# Altium schematic sheet BQ24073_锂电池充电.SchDoc
size A4; DocumentNumber: 16; SheetNumber: 16; SheetTotal: 34
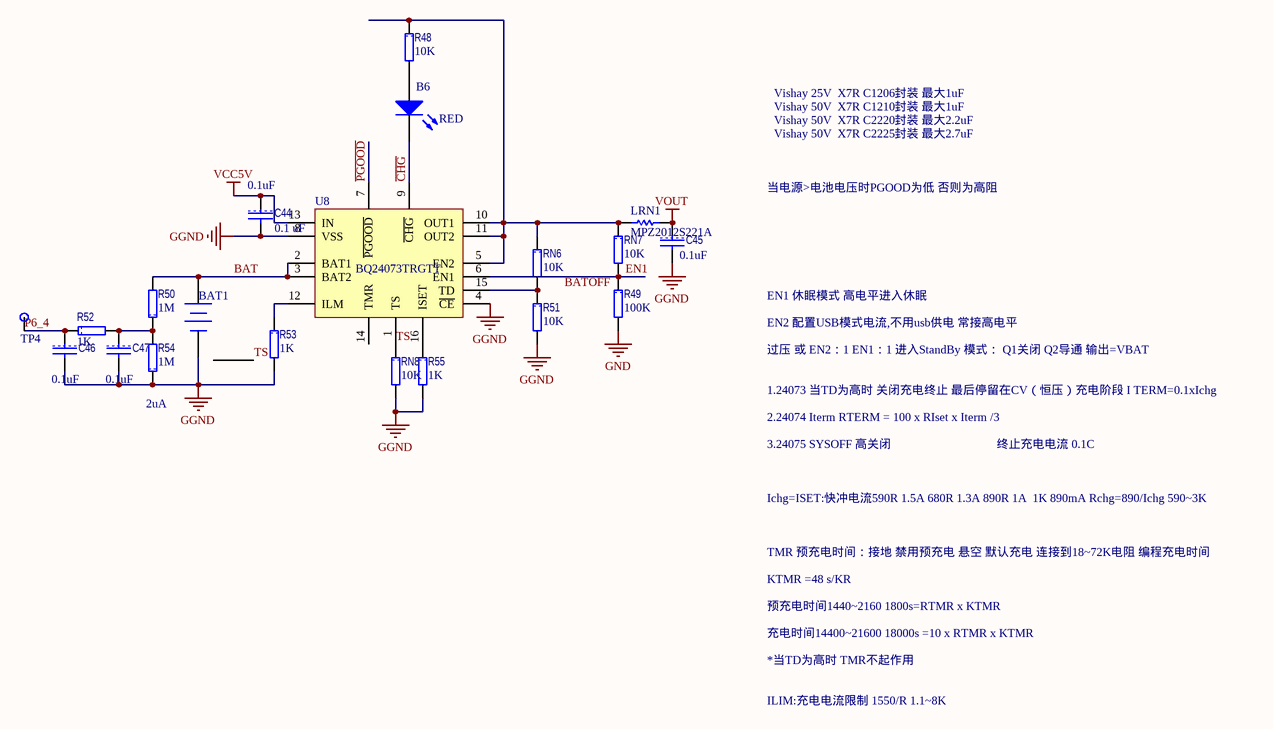
[diagram p0: BQ24073_锂电池充电.SchDoc]

## Parts
B6  RED  [0805LED]
BAT1  18650/5000mAH/3.7V  [BAT_3]  (value not drawn)
C44  value 0.1uF  电容: 0.1 uF  [1608[0603]C]  (hidden comment: C1608X7R1H104K)
C45  value 0.1uF  [1608[0603]C]  (hidden comment: C1608X7R1H104K)
C46  value 0.1uF  [1608[0603]C]  (hidden comment: C1608X7R1H104K)
C47  value 0.1uF  [1608[0603]C]  (hidden comment: C1608X7R1H104K)
LRN1  MPZ2012S221A  [2012[0805]]
R48  value 10K  [1608[0603]R]  (hidden comment: CRCW060310K0FKEA)
R49  value 100K  [1608[0603]R]  (hidden comment: CRCW0603100KFKEA)
R50  value 1M  [1608[0603]R]  (hidden comment: CRCW06031M00FKEA)
R51  value 10K  [1608[0603]R]  (hidden comment: CRCW060310K0FKEA)
R52  value 1K  [1608[0603]R]  (hidden comment: CRCW06031K00FKEA)
R53  value 1K  [1608[0603]R]  (hidden comment: CRCW06031K00FKEA)
R54  value 1M  [1608[0603]R]  (hidden comment: CRCW06031M00FKEA)
R55  value 1K  [1608[0603]R]  (hidden comment: CRCW06031K00FKEA)
RN6  value 10K  [1608[0603]RN]  (hidden comment: CRCW060310K0FKEA)
RN7  value 10K  [1608[0603]RN]  (hidden comment: CRCW060310K0FKEA)
RN8  value 10K  [1608[0603]RN]  (hidden comment: CRCW060310K0FKEA)
TP4  TP  [TP]  (value not drawn)
U8  BQ24073TRGTT  [BQ24073]

## Nets
GGND: BAT1.2(-) C44.2 C45.2 C46.2 C47.2 R51.2 R53.2 R54.1 R55.2 RN8.2 U8.4(~{CE}) U8.8(VSS)
GND: R49.2
VCC5V: C44.1 U8.13(IN)
VOUT: C45.1 LRN1.2
BAT: BAT1.1(+) R50.2 U8.2(BAT1) U8.3(BAT2)
~{CHG}: B6.2(K) U8.9(~{CHG})
EN1: R49.1 RN7.2 U8.6(EN1)
P6_4: C46.1 R52.1 TP4.1(TestPoint)
~{PGOOD}: U8.7(~{PGOOD})
TS: BAT1.3(TS) RN8.1 U8.1(TS)
NetB6_1: B6.1(A) R48.2
NetC47_1: C47.1 R50.1 R52.2 R54.2
NetLRN1_1: LRN1.1 R48.1 RN6.1 RN7.1 U8.5(EN2) U8.10(OUT1) U8.11(OUT2)
NetR51_1: R51.1 RN6.2 U8.15(TD)
NetR53_1: R53.1 U8.12(ILM)
NetR55_1: R55.1 U8.16(ISET)

Not connected (* = marked no-connect by the designer): U8 14(TMR)

## Notes on the sheet
- Vishay 25V  X7R C1206封装 最大1uF
- Vishay 50V  X7R C2225封装 最大2.7uF
- Vishay 50V  X7R C2220封装 最大2.2uF
- Vishay 50V  X7R C1210封装 最大1uF
- 当电源>电池电压时PGOOD为低 否则为高阻
- EN1 休眠模式 高电平进入休眠
- 过压 或 EN2：1 EN1：1 进入StandBy 模式： Q1关闭 Q2导通 输出=VBAT
- EN2 配置USB模式电流,不用usb供电 常接高电平
- (near R54) 2uA
- 1.24073 当TD为高时 关闭充电终止 最后停留在CV（恒压）充电阶段 I TERM=0.1xIchg
- 2.24074 Iterm RTERM = 100 x RIset x Iterm /3
- Ichg=ISET:快冲电流590R 1.5A 680R 1.3A 890R 1A  1K 890mA Rchg=890/Ichg 590~3K
- 3.24075 SYSOFF 高关闭
- 终止充电电流 0.1C
- TMR 预充电时间：接地 禁用预充电 悬空 默认充电 连接到18~72K电阻 编程充电时间
- KTMR =48 s/KR
- 预充电时间1440~2160 1800s=RTMR x KTMR
- 充电时间14400~21600 18000s =10 x RTMR x KTMR
- ILIM:充电电流限制 1550/R 1.1~8K
- *当TD为高时 TMR不起作用
- Labels drawn without touching a wire or pin: BATOFF

## Library data of the parts
B6 = LED2: Typical RED, GREEN, YELLOW, AMBER GaAs LED; Published: 8-Jun-2000; LatestRevisionDate: 17-Jul-2002; LatestRevisionNote: Re-released for DXP Platform.; PackageVersion: Feb-2002; PackageReference: 3.2X1.6X1.1; Publisher: Altium Limited; PackageDescription: SM LED; 2 Flat Leads
BAT1 = Battery: 插针 Multicell Battery
C44 C45 = CAP: 多层陶瓷电容器MLCC - SMD/SMT 0603 0.1uF 50volts X7R 10%; Manufacturer: TDK; 尺寸: 0.8 mm W x 1.6 mm L x 0.8 mm H; 工作温度范围: - 55 C to + 125 C; 封装 / 箱体: 0603 (1608 metric); 封装: Reel; 产品: General Type MLCCs; 系列: C; 电压额定值: 50 V; 电容-nF: 100 nF; 电容-pF: 100000 pF; 外壳代码 - in: 0603; 外壳代码 - mm: 1608; 产品种类: Low & Medium Capacitance SMD Ceramic Chip Capacitors; 标准包装数量: 4000; Supplier 1: Mouser; Supplier Part Number 1: 810-C1608X7R1H104K; Manufacturer Part Number: C1608X7R1H104K; RoHS: RoHS Compliant; Description 1: 多层陶瓷电容器MLCC - SMD/SMT 0603 0.1uF 50volts X7R 10%; Category: 多层陶瓷电容器MLCC - SMD/SMT; Stock 1: 224604; Pricing 1: 1=0.160, 50=0.070, 100=0.036, 500=0.019, 1000=0.013, 4000=0.010, 8000=0.009, 12000=0.008, 20000=0.007 (USD); 端接类型: SMD/SMT; 容差: 10 %; 制造商: TDK; 温度系数/代码: X7R; RoHS - 贸泽: Y; Minimum Order Quantity: 1; Reeling: True; ComponentLink1URL: http://www.tdk.com/pdf/general_B11.pdf; ComponentLink1Description: http://www.tdk.com/pdf/general_B11.pdf
  C45: 电容: 0.1 uF
C46 C47 = CAP: 多层陶瓷电容器MLCC - SMD/SMT 0603 0.1uF 50volts X7R 10%; Manufacturer: TDK; 产品: General Type MLCCs; 产品种类: Low & Medium Capacitance SMD Ceramic Chip Capacitors; 外壳代码 - in: 0603; 外壳代码 - mm: 1608; 封装 / 箱体: 0603 (1608 metric); 封装: Reel; 尺寸: 0.8 mm W x 1.6 mm L x 0.8 mm H; 工作温度范围: - 55 C to + 125 C; 标准包装数量: 4000; 电压额定值: 50 V; 电容-nF: 100 nF; 电容-pF: 100000 pF; 系列: C; Category: 多层陶瓷电容器MLCC - SMD/SMT; ComponentLink1Description: http://www.tdk.com/pdf/general_B11.pdf; ComponentLink1URL: http://www.tdk.com/pdf/general_B11.pdf; Description 1: 多层陶瓷电容器MLCC - SMD/SMT 0603 0.1uF 50volts X7R 10%; Manufacturer Part Number: C1608X7R1H104K; Minimum Order Quantity: 1; Pricing 1: 1=0.160, 50=0.070, 100=0.036, 500=0.019, 1000=0.013, 4000=0.010, 8000=0.009, 12000=0.008, 20000=0.007 (USD); Reeling: True; RoHS - 贸泽: Y; RoHS: RoHS Compliant; Stock 1: 224604; Supplier 1: Mouser; Supplier Part Number 1: 810-C1608X7R1H104K; 制造商: TDK; 容差: 10 %; 温度系数/代码: X7R; 电容: 0.1 uF; 端接类型: SMD/SMT
LRN1 = Res Semi: 电磁干扰滤波珠子、扼流圈和阵列 Ferrite Chip Beads; Manufacturer: TDK; 阻抗: 220 Ohms; 最大直流电流: 3 A; 最大直流电阻: 0.04 Ohms; 工作温度范围: - 55 C to + 125 C; 封装 / 箱体: 2012; 封装: Reel; 端接类型: SMD/SMT; 容差: 25 %; 产品种类: Ferrite Beads; 标准包装数量: 4000; Supplier 1: Mouser; Supplier Part Number 1: 810-MPZ2012S221A; Manufacturer Part Number: MPZ2012S221A; RoHS: RoHS Compliant; Description 1: 电磁干扰滤波珠子、扼流圈和阵列 Ferrite Chip Beads; Category: 电磁干扰滤波珠子、扼流圈和阵列; Stock 1: 26540; Pricing 1: 1=0.070, 50=0.060, 100=0.053, 500=0.040, 1000=0.035, 4000=0.031, 8000=0.029, 12000=0.025 (USD); 制造商: TDK; RoHS - 贸泽: Y; Minimum Order Quantity: 1; Reeling: True; ComponentLink1URL: http://www.mouser.com/ds/2/400/e9413_mpz-24582.pdf; ComponentLink1Description: http://www.mouser.com/ds/2/400/e9413_mpz-24582.pdf
R48 R51 RN6-RN8 = RES: 厚膜电阻器 - SMD 1/10watt 10Kohms 1%; Manufacturer: Vishay / Dale; 尺寸: 0.85 mm W x 1.55 mm L x 0.45 mm H; 工作温度范围: - 55 C to + 155 C; 封装 / 箱体: 0603 (1608 metric); 封装: Reel; 功率额定值: 100 mW; 产品: Thick Film Resistors SMD; 系列: CRCW; 温度系数: 100 PPM / K; 端接类型: SMD/SMT; 电压额定值: 75 V; 制造商: Vishay; 产品种类: 0603 Thick Film Chip Resistors; 标准包装数量: 5000; 外壳代码 - in: 0603; 外壳代码 - mm: 1608; Supplier 1: Mouser; Supplier Part Number 1: 71-CRCW0603-10K-E3; Manufacturer Part Number: CRCW060310K0FKEA; RoHS: RoHS Compliant By Exemption; Category: 厚膜电阻器 - SMD; Stock 1: 0; Pricing 1: 1=0.080, 10=0.013, 100=0.010, 1000=0.008, 5000=0.005, 25000=0.004, 50000=0.003 (USD); 电阻: 10 kOhms; 容差: 1 %; RoHS - 贸泽: E; Minimum Order Quantity: 1; Reeling: True; ComponentLink1URL: http://www.mouser.com/ds/2/427/dcrcwe3-109170.pdf; ComponentLink1Description: http://www.mouser.com/ds/2/427/dcrcwe3-109170.pdf; Description 1: 厚膜电阻器 - SMD 1/10watt 10Kohms 1%
R49 = RES: 厚膜电阻器 - SMD 1/10watt 100Kohms 1%; Manufacturer: Vishay / Dale; 尺寸: 0.85 mm W x 1.55 mm L x 0.45 mm H; 工作温度范围: - 55 C to + 155 C; 封装 / 箱体: 0603 (1608 metric); 封装: Reel; 功率额定值: 100 mW; 产品: Thick Film Resistors SMD; 系列: CRCW; 温度系数: 100 PPM / K; 端接类型: SMD/SMT; 电压额定值: 75 V; 制造商: Vishay; 产品种类: 0603 Thick Film Chip Resistors; 标准包装数量: 5000; 外壳代码 - in: 0603; 外壳代码 - mm: 1608; Supplier 1: Mouser; Supplier Part Number 1: 71-CRCW0603-100K-E3; Manufacturer Part Number: CRCW0603100KFKEA; RoHS: RoHS Compliant By Exemption; Category: 厚膜电阻器 - SMD; Stock 1: 175756; Pricing 1: 1=0.080, 10=0.013, 100=0.010, 1000=0.008, 5000=0.005, 25000=0.004, 50000=0.003 (USD); 电阻: 100 kOhms; 容差: 1 %; RoHS - 贸泽: E; Minimum Order Quantity: 1; Reeling: True; ComponentLink1URL: http://www.mouser.com/ds/2/427/dcrcwe3-109170.pdf; ComponentLink1Description: http://www.mouser.com/ds/2/427/dcrcwe3-109170.pdf; Description 1: 厚膜电阻器 - SMD 1/10watt 100Kohms 1%
R50 R54 = RES: 厚膜电阻器 - SMD 1/10watt 1.0Mohms 1%; Manufacturer: Vishay / Dale; 尺寸: 0.85 mm W x 1.55 mm L x 0.45 mm H; 工作温度范围: - 55 C to + 155 C; 封装 / 箱体: 0603 (1608 metric); 封装: Reel; 功率额定值: 100 mW; 产品: Thick Film Resistors SMD; 电阻: 1 MOhms; 系列: CRCW; 温度系数: 100 PPM / K; 端接类型: SMD/SMT; 电压额定值: 75 V; 外壳代码 - in: 0603; 外壳代码 - mm: 1608; 制造商: Vishay; 产品种类: 0603 Thick Film Chip Resistors; 标准包装数量: 5000; Supplier 1: Mouser; Supplier Part Number 1: 71-CRCW0603-1.0M-E3; Manufacturer Part Number: CRCW06031M00FKEA; RoHS: RoHS Compliant By Exemption; Category: 厚膜电阻器 - SMD; Stock 1: 71394; Pricing 1: 1=0.080, 10=0.013, 100=0.010, 1000=0.008, 5000=0.005, 25000=0.004, 50000=0.003 (USD); 容差: 1 %; RoHS - 贸泽: E; Minimum Order Quantity: 1; Reeling: True; ComponentLink1URL: http://www.mouser.com/ds/2/427/dcrcwe3-109170.pdf; ComponentLink1Description: http://www.mouser.com/ds/2/427/dcrcwe3-109170.pdf; Description 1: 厚膜电阻器 - SMD 1/10watt 1.0Mohms 1%
R52 R53 R55 = RES: 厚膜电阻器 - SMD 1/10watt 1.0Kohms 1%; Manufacturer: Vishay / Dale; 尺寸: 0.85 mm W x 1.55 mm L x 0.45 mm H; 工作温度范围: - 55 C to + 155 C; 封装 / 箱体: 0603 (1608 metric); 封装: Reel; 功率额定值: 100 mW; 产品: Thick Film Resistors SMD; 电阻: 1 kOhms; 系列: CRCW; 温度系数: 100 PPM / K; 端接类型: SMD/SMT; 电压额定值: 75 V; 制造商: Vishay; 产品种类: 0603 Thick Film Chip Resistors; 标准包装数量: 5000; 外壳代码 - in: 0603; 外壳代码 - mm: 1608; Supplier 1: Mouser; Supplier Part Number 1: 71-CRCW0603-1.0K-E3; Manufacturer Part Number: CRCW06031K00FKEA; RoHS: RoHS Compliant By Exemption; Category: 厚膜电阻器 - SMD; Stock 1: 276938; Pricing 1: 1=0.080, 10=0.013, 100=0.010, 1000=0.008, 5000=0.005, 25000=0.004, 50000=0.003 (USD); 容差: 1 %; RoHS - 贸泽: E; Minimum Order Quantity: 1; Reeling: True; ComponentLink1URL: http://www.mouser.com/ds/2/427/dcrcwe3-109170.pdf; ComponentLink1Description: http://www.mouser.com/ds/2/427/dcrcwe3-109170.pdf; Description 1: 厚膜电阻器 - SMD 1/10watt 1.0Kohms 1%
TP4 = Test Point
U8 = BQ24073: 电池管理 1.5A USB-Friendly Li Ion Batt Charger; Manufacturer: Texas Instruments; Manufacturer Part Number: BQ24075TRGTT; 输出电流: 5 A; 输出电压: 5.5 V; 封装 / 箱体: QFN-16; 封装: Reel; 系列: BQ24075T; 电荷安全定时器: Yes; 安装风格: SMD/SMT; 电池类型: Li-Ion; 最大功率耗散: 2.3 W; 工作电源电流: 1.5 mA; 工作电源电压: 4.35 V to 26 V; 产品种类: Battery Management; 产品类型: Charge Management; 标准包装数量: 250; Supplier 1: Mouser; Supplier Part Number 1: 595-BQ24075TRGTT; RoHS: RoHS Compliant; Description 1: 电池管理 1.5A USB-Friendly Li Ion Batt Charger; Category: 电池管理; Stock 1: 641; Pricing 1: 1=2.60, 10=2.33, 25=2.08, 50=1.96, 100=1.40, 250=1.37, 500=1.35, 750=1.32, 1000=1.30 (USD); 温度监测: Yes; 制造商: Texas Instruments; RoHS - 贸泽: Y; Minimum Order Quantity: 1; Reeling: True; ComponentLink1URL: http://www.mouser.com/ds/2/405/slus937a-120341.pdf; ComponentLink1Description: http://www.mouser.com/ds/2/405/slus937a-120341.pdf